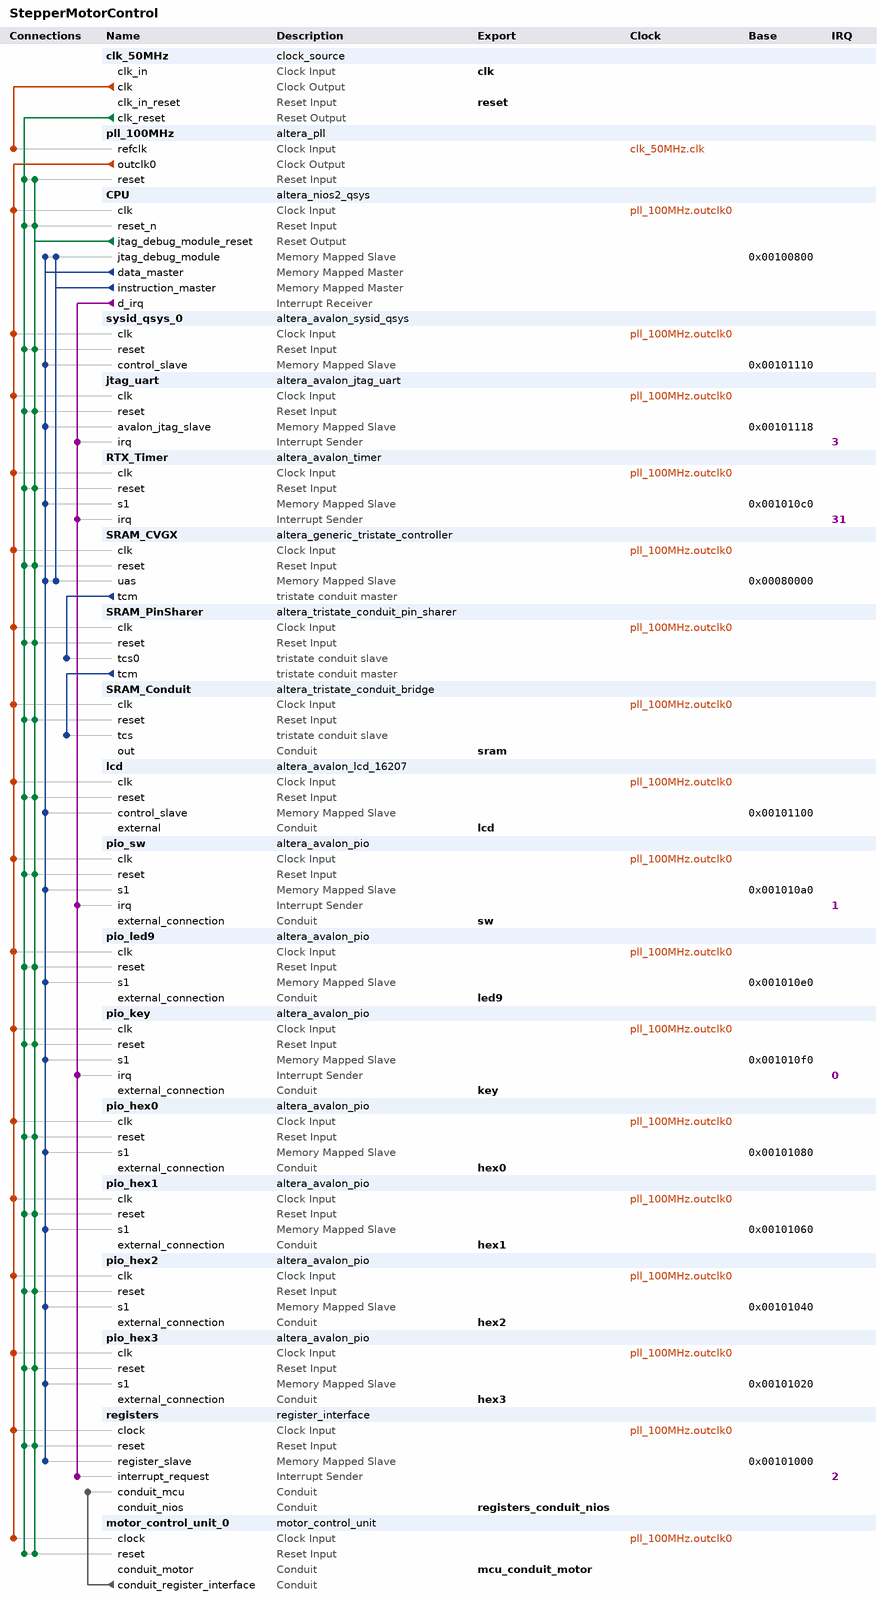
[diagram p0: system contents]
# Platform Designer (Qsys) system StepperMotorControl, Cyclone V 5CGXFC5C6F27C7
# Parameters at their usual value, and those the tool derives, are not listed.
package require -exact qsys 14.0
create_system StepperMotorControl
set_project_property DEVICE_FAMILY {Cyclone V}
set_project_property DEVICE 5CGXFC5C6F27C7

add_instance clk_50MHz clock_source 14.0
set_instance_parameter_value clk_50MHz clockFrequency 50000000

add_instance pll_100MHz altera_pll 14.0
set_instance_parameter_value pll_100MHz gui_device_speed_grade 1
set_instance_parameter_value pll_100MHz gui_pll_mode {Integer-N PLL}
set_instance_parameter_value pll_100MHz gui_reference_clock_frequency 50.0
set_instance_parameter_value pll_100MHz gui_operation_mode direct
set_instance_parameter_value pll_100MHz gui_use_locked false
set_instance_parameter_value pll_100MHz gui_number_of_clocks 1
set_instance_parameter_value pll_100MHz gui_output_clock_frequency0 100.0

add_instance CPU altera_nios2_qsys 14.0
set_instance_parameter_value CPU resetrequest_enabled true
set_instance_parameter_value CPU resetSlave SRAM_CVGX.uas
set_instance_parameter_value CPU mmu_TLBMissExcSlave None
set_instance_parameter_value CPU exceptionSlave SRAM_CVGX.uas
set_instance_parameter_value CPU breakSlave CPU.jtag_debug_module
set_instance_parameter_value CPU impl Small
set_instance_parameter_value CPU icache_size 1024
set_instance_parameter_value CPU debug_level Level2

add_instance sysid_qsys_0 altera_avalon_sysid_qsys 14.0
set_instance_parameter_value sysid_qsys_0 id 67108864

add_instance jtag_uart altera_avalon_jtag_uart 14.0
set_instance_parameter_value jtag_uart simInteractiveOptions NO_INTERACTIVE_WINDOWS

add_instance RTX_Timer altera_avalon_timer 14.0
set_instance_parameter_value RTX_Timer period 10
set_instance_parameter_value RTX_Timer periodUnits MSEC

add_instance SRAM_CVGX altera_generic_tristate_controller 14.0
set_instance_parameter_value SRAM_CVGX TCM_ADDRESS_W 19
set_instance_parameter_value SRAM_CVGX TCM_DATA_W 16
set_instance_parameter_value SRAM_CVGX TCM_BYTEENABLE_W 2
set_instance_parameter_value SRAM_CVGX TCM_READ_WAIT 10
set_instance_parameter_value SRAM_CVGX TCM_WRITE_WAIT 10
set_instance_parameter_value SRAM_CVGX TCM_SETUP_WAIT 10
set_instance_parameter_value SRAM_CVGX TCM_DATA_HOLD 10
set_instance_parameter_value SRAM_CVGX TCM_MAX_PENDING_READ_TRANSACTIONS 3
set_instance_parameter_value SRAM_CVGX TCM_TURNAROUND_TIME 2
set_instance_parameter_value SRAM_CVGX TCM_TIMING_UNITS 0
set_instance_parameter_value SRAM_CVGX TCM_READLATENCY 2
set_instance_parameter_value SRAM_CVGX TCM_SYMBOLS_PER_WORD 2
set_instance_parameter_value SRAM_CVGX USE_READ 0
set_instance_parameter_value SRAM_CVGX USE_BEGINTRANSFER 0
set_instance_parameter_value SRAM_CVGX USE_BYTEENABLE 1
set_instance_parameter_value SRAM_CVGX USE_OUTPUTENABLE 1
set_instance_parameter_value SRAM_CVGX ACTIVE_LOW_READ 0
set_instance_parameter_value SRAM_CVGX ACTIVE_LOW_BYTEENABLE 1
set_instance_parameter_value SRAM_CVGX ACTIVE_LOW_OUTPUTENABLE 1
set_instance_parameter_value SRAM_CVGX ACTIVE_LOW_BEGINTRANSFER 0
set_instance_parameter_value SRAM_CVGX CHIPSELECT_THROUGH_READLATENCY 0
set_instance_parameter_value SRAM_CVGX MODULE_ASSIGNMENT_KEYS embeddedsw.configuration.hwClassnameDriverSupportList,embeddedsw.CMacro.SRAM_MEMORY_SIZE,embeddedsw.CMacro.SRAM_MEMORY_UNITS,embeddedsw.CMacro.SRAM_DATA_WIDTH,embeddedsw.memoryInfo.MEM_INIT_DATA_WIDTH,embeddedsw.memoryInfo.HAS_BYTE_LANE,embeddedsw.memoryInfo.GENERATE_DAT_SYM,embeddedsw.memoryInfo.DAT_SYM_INSTALL_DIR
set_instance_parameter_value SRAM_CVGX MODULE_ASSIGNMENT_VALUES altera_avalon_lan91c111:altera_avalon_cfi_flash,524288,1,16,16,1,1,SIM_DIR
set_instance_parameter_value SRAM_CVGX INTERFACE_ASSIGNMENT_KEYS embeddedsw.configuration.isMemoryDevice
set_instance_parameter_value SRAM_CVGX INTERFACE_ASSIGNMENT_VALUES 1

add_instance SRAM_PinSharer altera_tristate_conduit_pin_sharer 14.0
set_instance_parameter_value SRAM_PinSharer NUM_INTERFACES 1
set_instance_parameter_value SRAM_PinSharer MODULE_ORIGIN_LIST SRAM_CVGX.tcm,SRAM_CVGX.tcm,SRAM_CVGX.tcm,SRAM_CVGX.tcm,SRAM_CVGX.tcm,SRAM_CVGX.tcm
set_instance_parameter_value SRAM_PinSharer SIGNAL_ORIGIN_LIST address,outputenable_n,byteenable_n,write_n,data,chipselect_n
set_instance_parameter_value SRAM_PinSharer SHARED_SIGNAL_LIST SRAM_A,SRAM_OE_N,SRAM_BE_N,SRAM_WE_N,SRAM_D,SRAM_CE_N

add_instance SRAM_Conduit altera_tristate_conduit_bridge 14.0

add_instance lcd altera_avalon_lcd_16207 14.0

add_instance pio_sw altera_avalon_pio 14.0
set_instance_parameter_value pio_sw bitModifyingOutReg true
set_instance_parameter_value pio_sw captureEdge true
set_instance_parameter_value pio_sw direction Input
set_instance_parameter_value pio_sw edgeType ANY
set_instance_parameter_value pio_sw generateIRQ true
set_instance_parameter_value pio_sw irqType EDGE
set_instance_parameter_value pio_sw width 10

add_instance pio_led9 altera_avalon_pio 14.0
set_instance_parameter_value pio_led9 direction Output
set_instance_parameter_value pio_led9 width 1

add_instance pio_key altera_avalon_pio 14.0
set_instance_parameter_value pio_key captureEdge true
set_instance_parameter_value pio_key direction Input
set_instance_parameter_value pio_key edgeType FALLING
set_instance_parameter_value pio_key generateIRQ true
set_instance_parameter_value pio_key irqType EDGE
set_instance_parameter_value pio_key width 4

add_instance pio_hex0 altera_avalon_pio 14.0
set_instance_parameter_value pio_hex0 bitModifyingOutReg true
set_instance_parameter_value pio_hex0 direction Output
set_instance_parameter_value pio_hex0 width 7

add_instance pio_hex1 altera_avalon_pio 14.0
set_instance_parameter_value pio_hex1 bitModifyingOutReg true
set_instance_parameter_value pio_hex1 direction Output
set_instance_parameter_value pio_hex1 width 7

add_instance pio_hex2 altera_avalon_pio 14.0
set_instance_parameter_value pio_hex2 bitModifyingOutReg true
set_instance_parameter_value pio_hex2 direction Output
set_instance_parameter_value pio_hex2 width 7

add_instance pio_hex3 altera_avalon_pio 14.0
set_instance_parameter_value pio_hex3 bitModifyingOutReg true
set_instance_parameter_value pio_hex3 direction Output
set_instance_parameter_value pio_hex3 width 7

add_instance registers register_interface 2.0.0

add_instance motor_control_unit_0 motor_control_unit 1.0
set_instance_parameter_value motor_control_unit_0 divider 125000

# connections
add_connection clk_50MHz.clk pll_100MHz.refclk clock
add_connection pll_100MHz.outclk0 CPU.clk clock
add_connection pll_100MHz.outclk0 jtag_uart.clk clock
add_connection pll_100MHz.outclk0 lcd.clk clock
add_connection pll_100MHz.outclk0 motor_control_unit_0.clock clock
add_connection pll_100MHz.outclk0 pio_hex0.clk clock
add_connection pll_100MHz.outclk0 pio_hex1.clk clock
add_connection pll_100MHz.outclk0 pio_hex2.clk clock
add_connection pll_100MHz.outclk0 pio_hex3.clk clock
add_connection pll_100MHz.outclk0 pio_key.clk clock
add_connection pll_100MHz.outclk0 pio_led9.clk clock
add_connection pll_100MHz.outclk0 pio_sw.clk clock
add_connection pll_100MHz.outclk0 registers.clock clock
add_connection pll_100MHz.outclk0 RTX_Timer.clk clock
add_connection pll_100MHz.outclk0 SRAM_Conduit.clk clock
add_connection pll_100MHz.outclk0 SRAM_CVGX.clk clock
add_connection pll_100MHz.outclk0 SRAM_PinSharer.clk clock
add_connection pll_100MHz.outclk0 sysid_qsys_0.clk clock
add_connection clk_50MHz.clk_reset CPU.reset_n reset
add_connection clk_50MHz.clk_reset jtag_uart.reset reset
add_connection clk_50MHz.clk_reset lcd.reset reset
add_connection clk_50MHz.clk_reset motor_control_unit_0.reset reset
add_connection clk_50MHz.clk_reset pio_hex0.reset reset
add_connection clk_50MHz.clk_reset pio_hex1.reset reset
add_connection clk_50MHz.clk_reset pio_hex2.reset reset
add_connection clk_50MHz.clk_reset pio_hex3.reset reset
add_connection clk_50MHz.clk_reset pio_key.reset reset
add_connection clk_50MHz.clk_reset pio_led9.reset reset
add_connection clk_50MHz.clk_reset pio_sw.reset reset
add_connection clk_50MHz.clk_reset pll_100MHz.reset reset
add_connection clk_50MHz.clk_reset registers.reset reset
add_connection clk_50MHz.clk_reset RTX_Timer.reset reset
add_connection clk_50MHz.clk_reset SRAM_Conduit.reset reset
add_connection clk_50MHz.clk_reset SRAM_CVGX.reset reset
add_connection clk_50MHz.clk_reset SRAM_PinSharer.reset reset
add_connection clk_50MHz.clk_reset sysid_qsys_0.reset reset
add_connection CPU.jtag_debug_module_reset CPU.reset_n reset
add_connection CPU.jtag_debug_module_reset jtag_uart.reset reset
add_connection CPU.jtag_debug_module_reset lcd.reset reset
add_connection CPU.jtag_debug_module_reset motor_control_unit_0.reset reset
add_connection CPU.jtag_debug_module_reset pio_hex0.reset reset
add_connection CPU.jtag_debug_module_reset pio_hex1.reset reset
add_connection CPU.jtag_debug_module_reset pio_hex2.reset reset
add_connection CPU.jtag_debug_module_reset pio_hex3.reset reset
add_connection CPU.jtag_debug_module_reset pio_key.reset reset
add_connection CPU.jtag_debug_module_reset pio_led9.reset reset
add_connection CPU.jtag_debug_module_reset pio_sw.reset reset
add_connection CPU.jtag_debug_module_reset pll_100MHz.reset reset
add_connection CPU.jtag_debug_module_reset registers.reset reset
add_connection CPU.jtag_debug_module_reset RTX_Timer.reset reset
add_connection CPU.jtag_debug_module_reset SRAM_Conduit.reset reset
add_connection CPU.jtag_debug_module_reset SRAM_CVGX.reset reset
add_connection CPU.jtag_debug_module_reset SRAM_PinSharer.reset reset
add_connection CPU.jtag_debug_module_reset sysid_qsys_0.reset reset
add_connection CPU.data_master CPU.jtag_debug_module avalon
set_connection_parameter_value CPU.data_master/CPU.jtag_debug_module baseAddress 0x00100800
add_connection CPU.data_master jtag_uart.avalon_jtag_slave avalon
set_connection_parameter_value CPU.data_master/jtag_uart.avalon_jtag_slave baseAddress 0x00101118
add_connection CPU.data_master lcd.control_slave avalon
set_connection_parameter_value CPU.data_master/lcd.control_slave baseAddress 0x00101100
add_connection CPU.data_master pio_hex0.s1 avalon
set_connection_parameter_value CPU.data_master/pio_hex0.s1 baseAddress 0x00101080
add_connection CPU.data_master pio_hex1.s1 avalon
set_connection_parameter_value CPU.data_master/pio_hex1.s1 baseAddress 0x00101060
add_connection CPU.data_master pio_hex2.s1 avalon
set_connection_parameter_value CPU.data_master/pio_hex2.s1 baseAddress 0x00101040
add_connection CPU.data_master pio_hex3.s1 avalon
set_connection_parameter_value CPU.data_master/pio_hex3.s1 baseAddress 0x00101020
add_connection CPU.data_master pio_key.s1 avalon
set_connection_parameter_value CPU.data_master/pio_key.s1 baseAddress 0x001010f0
add_connection CPU.data_master pio_led9.s1 avalon
set_connection_parameter_value CPU.data_master/pio_led9.s1 baseAddress 0x001010e0
add_connection CPU.data_master pio_sw.s1 avalon
set_connection_parameter_value CPU.data_master/pio_sw.s1 baseAddress 0x001010a0
add_connection CPU.data_master registers.register_slave avalon
set_connection_parameter_value CPU.data_master/registers.register_slave baseAddress 0x00101000
add_connection CPU.data_master RTX_Timer.s1 avalon
set_connection_parameter_value CPU.data_master/RTX_Timer.s1 baseAddress 0x001010c0
add_connection CPU.data_master SRAM_CVGX.uas avalon
set_connection_parameter_value CPU.data_master/SRAM_CVGX.uas baseAddress 0x00080000
add_connection CPU.data_master sysid_qsys_0.control_slave avalon
set_connection_parameter_value CPU.data_master/sysid_qsys_0.control_slave baseAddress 0x00101110
add_connection CPU.instruction_master CPU.jtag_debug_module avalon
set_connection_parameter_value CPU.instruction_master/CPU.jtag_debug_module baseAddress 0x00100800
add_connection CPU.instruction_master SRAM_CVGX.uas avalon
set_connection_parameter_value CPU.instruction_master/SRAM_CVGX.uas baseAddress 0x00080000
add_connection motor_control_unit_0.conduit_register_interface registers.conduit_mcu conduit
add_connection CPU.d_irq jtag_uart.irq interrupt
set_connection_parameter_value CPU.d_irq/jtag_uart.irq irqNumber 3
add_connection CPU.d_irq pio_key.irq interrupt
set_connection_parameter_value CPU.d_irq/pio_key.irq irqNumber 0
add_connection CPU.d_irq pio_sw.irq interrupt
set_connection_parameter_value CPU.d_irq/pio_sw.irq irqNumber 1
add_connection CPU.d_irq registers.interrupt_request interrupt
set_connection_parameter_value CPU.d_irq/registers.interrupt_request irqNumber 2
add_connection CPU.d_irq RTX_Timer.irq interrupt
set_connection_parameter_value CPU.d_irq/RTX_Timer.irq irqNumber 31
add_connection SRAM_CVGX.tcm SRAM_PinSharer.tcs0 tristate_conduit
add_connection SRAM_PinSharer.tcm SRAM_Conduit.tcs tristate_conduit

# exported interfaces
add_interface reset reset sink
set_interface_property reset EXPORT_OF clk_50MHz.clk_in_reset
add_interface clk clock sink
set_interface_property clk EXPORT_OF clk_50MHz.clk_in
add_interface sram conduit end
set_interface_property sram EXPORT_OF SRAM_Conduit.out
add_interface sw conduit end
set_interface_property sw EXPORT_OF pio_sw.external_connection
add_interface lcd conduit end
set_interface_property lcd EXPORT_OF lcd.external
add_interface key conduit end
set_interface_property key EXPORT_OF pio_key.external_connection
add_interface hex0 conduit end
set_interface_property hex0 EXPORT_OF pio_hex0.external_connection
add_interface hex1 conduit end
set_interface_property hex1 EXPORT_OF pio_hex1.external_connection
add_interface hex2 conduit end
set_interface_property hex2 EXPORT_OF pio_hex2.external_connection
add_interface hex3 conduit end
set_interface_property hex3 EXPORT_OF pio_hex3.external_connection
add_interface led9 conduit end
set_interface_property led9 EXPORT_OF pio_led9.external_connection
add_interface registers_conduit_nios conduit end
set_interface_property registers_conduit_nios EXPORT_OF registers.conduit_nios
add_interface mcu_conduit_motor conduit end
set_interface_property mcu_conduit_motor EXPORT_OF motor_control_unit_0.conduit_motor

set_interconnect_requirement {$system} qsys_mm.clockCrossingAdapter HANDSHAKE
set_interconnect_requirement {$system} qsys_mm.maxAdditionalLatency 1
set_interconnect_requirement {$system} qsys_mm.insertDefaultSlave FALSE

save_system StepperMotorControl.qsys
